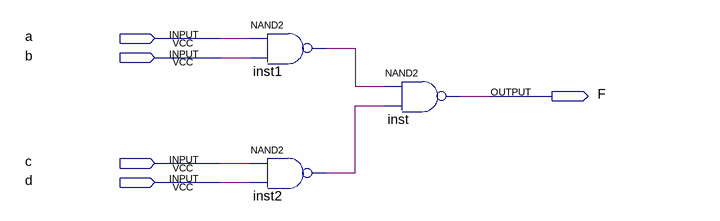
[diagram p0: schematic sheet]
// Quartus schematic Exercise1Question1.bdf as structural Verilog: 3 symbols, 5 pins
module Exercise1Question1 (
  input  a,
  input  b,
  input  c,
  input  d,
  output F
);

  wire inst1_out, inst2_out;

  nand inst1 (inst1_out, a, b);
  nand inst2 (inst2_out, c, d);
  nand inst (F, inst1_out, inst2_out);
endmodule
